# Altium schematic sheet WiFi.SchDoc
size A4; DocumentNumber: 8; SheetNumber: 8; SheetTotal: 8
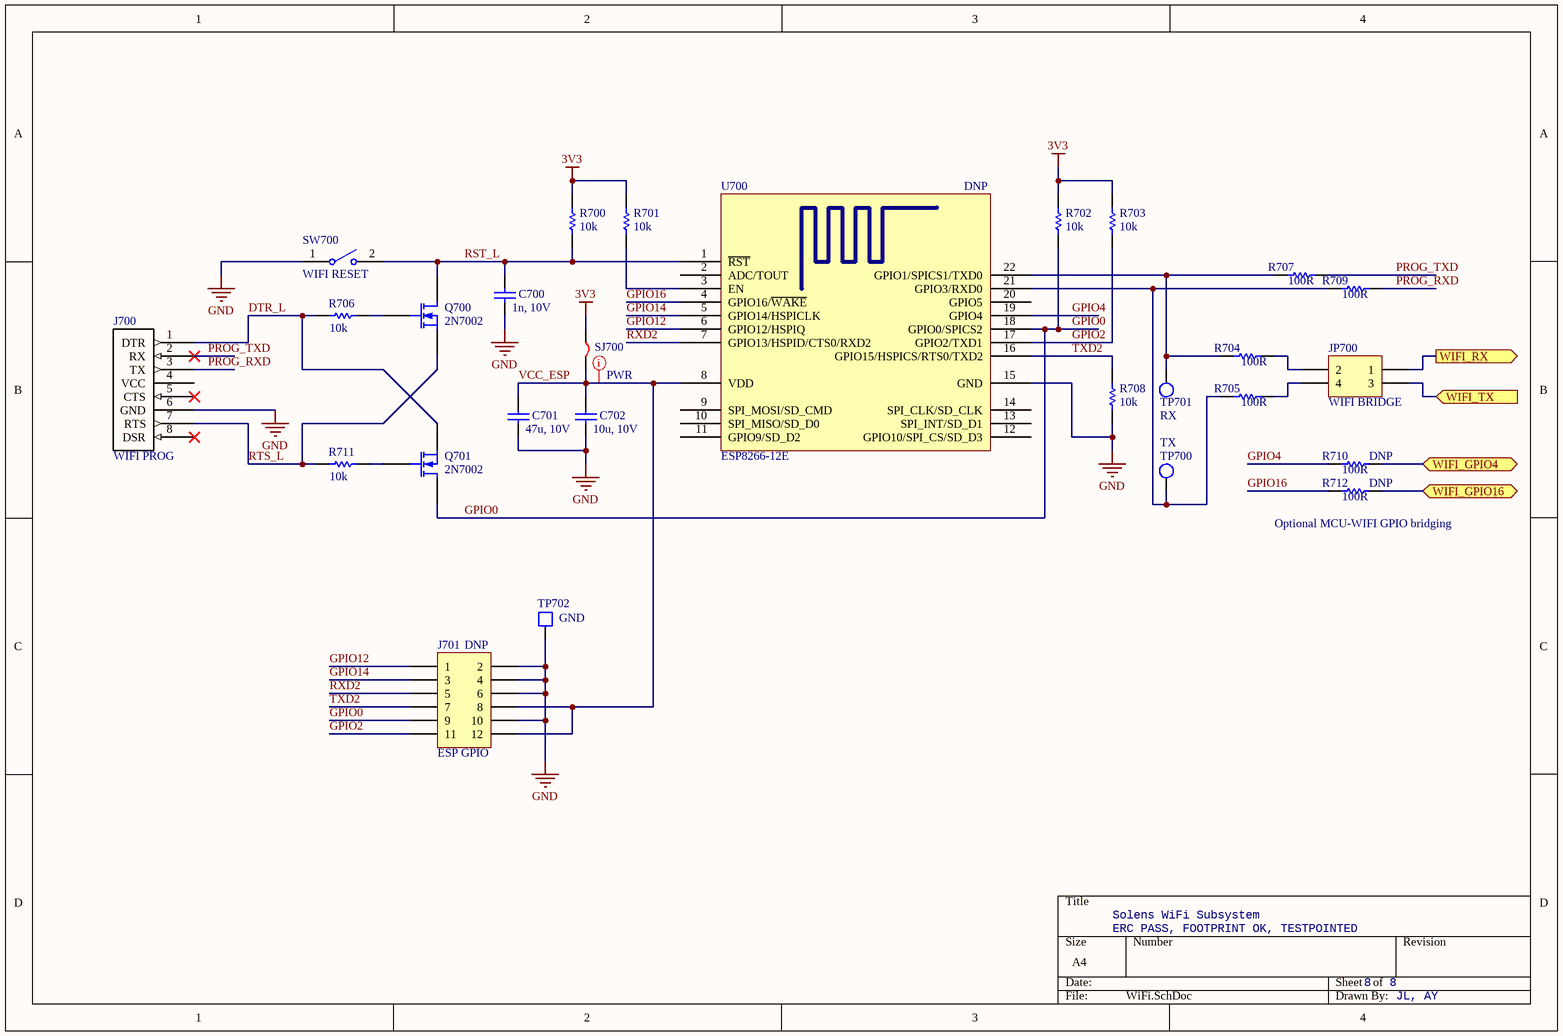
[diagram p0: WiFi.SchDoc]

## Parts
C700  value 1n, 10V  [CAP_0805]  (hidden comment: 1n, 16V, 0805)
C701  value 47u, 10V  [CAP_1206]  (hidden comment: 47u, 10V, 1206)
C702  value 10u, 10V  [CAP_1206]  (hidden comment: 10u, 10V, 1206)
J700  Function: WIFI PROG  [HDR1X8]  (hidden comment: HDR_1x8_100TH_THT)
J701  Function: ESP GPIO  [HDR_100TH_2X6_SMT]  (hidden comment: HDR_2x6_100TH_SMT (DNP))
JP700  Function: WIFI BRIDGE  [HDR2X2]  (hidden comment: HDR_2x2_100TH_THT)
Q700  PartNumber: 2N7002  [SOT95P240X100-3N (CMPSH1-4 TR)]  (hidden comment: 2N7002, SOT-23)
Q701  PartNumber: 2N7002  [SOT95P240X100-3N (CMPSH1-4 TR)]  (hidden comment: 2N7002, SOT-23)
R700  value 10k  [RES_0805]  (hidden comment: 10k, 1/8W, 0805)
R701  value 10k  [RES_0805]  (hidden comment: 10k, 1/8W, 0805)
R702  value 10k  [RES_0805]  (hidden comment: 10k, 1/8W, 0805)
R703  value 10k  [RES_0805]  (hidden comment: 10k, 1/8W, 0805)
R704  value 100R  [RES_0805]  (hidden comment: 100R, 1/8W, 0805)
R705  value 100R  [RES_0805]  (hidden comment: 100R, 1/8W, 0805)
R706  value 10k  [RES_0805]  (hidden comment: 10k, 1/8W, 0805)
R707  value 100R  [RES_0805]  (hidden comment: 100R, 1/8W, 0805)
R708  value 10k  [RES_0805]  (hidden comment: 10k, 1/8W, 0805)
R709  value 100R  [RES_0805]  (hidden comment: 100R, 1/8W, 0805)
R710  value 100R  [RES_0805]  (hidden comment: 100R, 1/8W, 0805 (DNP))
R711  value 10k  [RES_0805]  (hidden comment: 10k, 1/8W, 0805)
R712  value 100R  [RES_0805]  (hidden comment: 100R, 1/8W, 0805 (DNP))
SJ700  SJ, 1206 (DNP)  [SJ_1206]  (value not drawn)
SW700  Function: WIFI RESET  [4341x10438x6]  (hidden comment: 434121043816, TACT SPST NO)
TP700  VisibleNetName: TX  [TP_SMALL]  (hidden comment: TP (DNP))
TP701  VisibleNetName: RX  [TP_SMALL]  (hidden comment: TP (DNP))
TP702  VisibleNetName: GND  [TP_LARGE]  (hidden comment: TP (DNP))
U700  PartNumber: ESP8266-12E  [ESP8266 ESP-12-E]  (hidden comment: ESP8266-12E (DNP))

## Ports
WIFI_GPIO4 (bidir), WIFI_GPIO16 (bidir), WIFI_RX (out), WIFI_TX (in)

## Nets
3V3: R700.2 R701.2 R702.1 R703.1 SJ700.1
GND: C700.2 C701.2 C702.2 J700.6(GND) J701.2 J701.4 J701.6 J701.10 R708.1 SW700.1 TP702.1 U700.15(GND)
DTR_L: J700.1(DTR) Q701.2(S) R706.2
GPIO0: J701.9 Q701.3(D) R702.2 U700.18(GPIO0/SPICS2)
GPIO2: J701.11 R703.2 U700.17(GPIO2/TXD1)
GPIO4: R710.1 U700.19(GPIO4)
GPIO12: J701.1 U700.6(GPIO12/HSPIQ)
GPIO14: J701.3 U700.5(GPIO14/HSPICLK)
GPIO16: R712.1 U700.4(GPIO16/~{WAKE})
PROG_RXD: J700.3(TX) R709.2
PROG_TXD: J700.2(RX) R707.2
RST_L: C700.1 Q700.3(D) R700.1 SW700.2 U700.1(~{RST})
RTS_L: J700.7(RTS) Q700.2(S) R711.2
RXD2: J701.5 U700.7(GPIO13/HSPID/CTS0/RXD2)
TXD2: J701.7 R708.2 U700.16(GPIO15/HSPICS/RTS0/TXD2)
VCC_ESP: C701.1 C702.1 J701.8 J701.12 SJ700.2 U700.8(VDD)
WIFI_GPIO4: R710.2 ; port WIFI_GPIO4
WIFI_GPIO16: R712.2 ; port WIFI_GPIO16
WIFI_RX: JP700.1 ; port WIFI_RX
WIFI_TX: JP700.3 ; port WIFI_TX
NetJP700_2: JP700.2 R704.2
NetJP700_4: JP700.4 R705.2
NetQ700_1: Q700.1(G) R706.1
NetQ701_1: Q701.1(G) R711.1
NetR701_1: R701.1 U700.3(EN)
NetR704_1: R704.1 R707.1 TP701.1 U700.22(GPIO1/SPICS1/TXD0)
NetR705_1: R705.1 R709.1 TP700.1 U700.21(GPIO3/RXD0)

Not connected (* = marked no-connect by the designer): J700 4(VCC) 5(CTS)* 8(DSR)*; U700 2(ADC/TOUT) 9(SPI_MOSI/SD_CMD) 10(SPI_MISO/SD_D0) 11(GPIO9/SD_D2) 12(GPIO10/SPI_CS/SD_D3) 13(SPI_INT/SD_D1) 14(SPI_CLK/SD_CLK) 20(GPIO5)

## Layout directives
net class PWR: VCC_ESP

## Notes on the sheet
- (near R712) Optional MCU-WIFI GPIO bridging
- Solens WiFi Subsystem
- ERC PASS, FOOTPRINT OK, TESTPOINTED
- JL, AY

## Library data of the parts
C700-C702 = Cap: Capacitor
  C700: DigikeyPN: 1276-1020-1-ND
  C701: DigikeyPN: 1276-3063-1-ND
  C702: DigikeyPN: 1276-1312-1-ND
J700 = HDR_FTDI_EXTENDED: DigikeyPN: 609-3264-ND; Value: HDR_1x8_100TH_THT
J701 = Header 6X2: Header, 6-Pin, Dual row; DigikeyPN: WM17452-ND; DNP: DNP; Value: HDR_2x6_100TH_SMT
JP700 = Header 2X2: Header, 2-Pin, Dual row; DigikeyPN: 609-3201-ND; Value: HDR_2x2_100TH_THT
Q700 Q701 = MOSFET-N: N-Channel MOSFET; PackageName: SOT23; DigikeyPN: 568-5818-1-ND; Value: 2N7002
R700-R712 = Res1: Resistor
  R700-R703 R706 R708 R711: DigikeyPN: 311-10.0KCRCT-ND
  R704 R705 R707 R709: DigikeyPN: 311-100CRCT-ND
  R710 R712: DigikeyPN: 311-100CRCT-ND; DNP: DNP
SJ700 = SJ: Solder jumper; Value: SJ_1206 (DNP); DNP: DNP
SW700 = WS-TASV, 434121043816: WS-TASV 6.0x3.5 mm SMD; Manufacturer: Wurth Elektronik; PartNumber: 434121043816; ComponentLink1URL: http://www.we-online.de; Created by: Baojun Chen; Created Date: Dec.2015; ComponentLink2URL: http://katalog.we-online.de/em/datasheet/4341x1xxx8x6.pdf; DigikeyPN: 732-7046-1-ND; Value: 434121043816
TP700 TP701 = TP_SMALL: Value: TP_SMALL (DNP); DigikeyPN: 36-5015CT-ND; DNP: DNP
TP702 = TP_LARGE: Value: TP_LARGE (DNP); DigikeyPN: 36-5016CT-ND; DNP: DNP
U700 = ESP8266 ESP-12-E: DNP: DNP; Value: ESP8266-12E